# Altium schematic sheet Sheet1.SchDoc
size A4
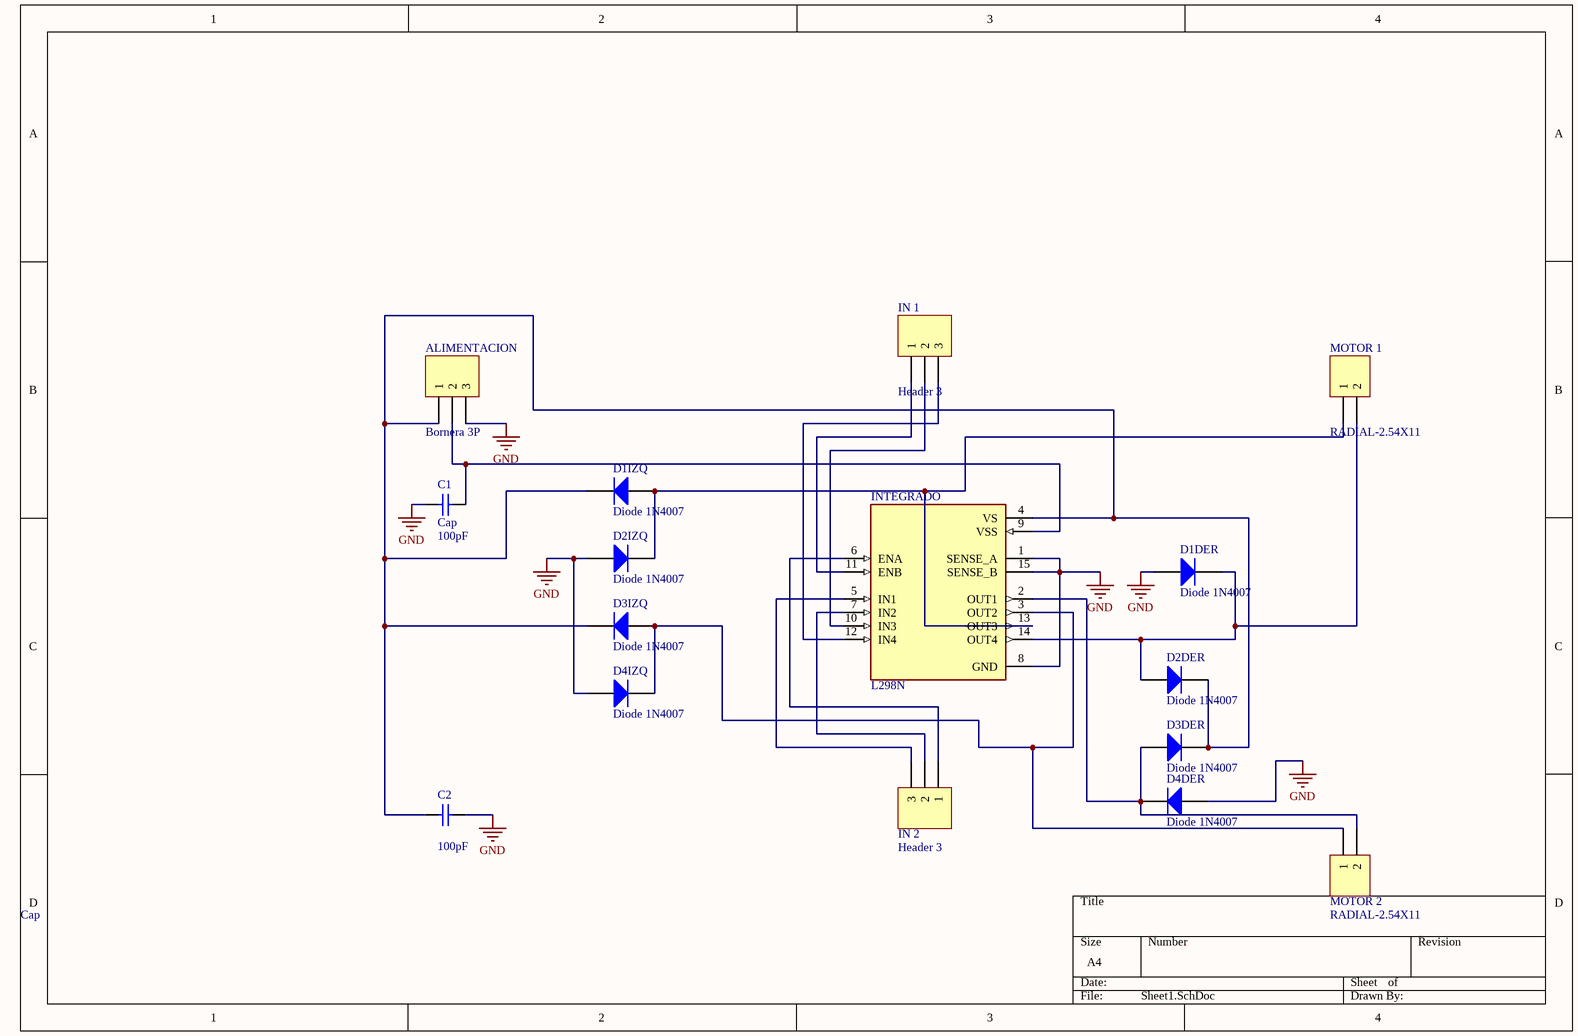
[diagram p0: Sheet1.SchDoc]

## Parts
ALIMENTACION  Bornera 3P  [Bornera 3P]
C1  Cap  value 100pF  [Capacitor]
C2  Cap  value 100pF  [Capacitor]
D1DER  Diode 1N4007  [Axial diodo]
D1IZQ  Diode 1N4007  [Axial diodo]
D2DER  Diode 1N4007  [Axial diodo]
D2IZQ  Diode 1N4007  [Axial diodo]
D3DER  Diode 1N4007  [Axial diodo]
D3IZQ  Diode 1N4007  [Axial diodo]
D4DER  Diode 1N4007  [Axial diodo]
D4IZQ  Diode 1N4007  [Axial diodo]
IN_1  Header 3  [HDR1X3]
IN_2  Header 3  [HDR1X3]
INTEGRADO  L298N  [l298n]
MOTOR_1  RADIAL-2.54X11  [Bornera 2P]
MOTOR_2  RADIAL-2.54X11  [Bornera 2P]

## Nets
GND: ALIMENTACION.3 C1.1 C2.2 D1DER.1(A) D2IZQ.1(A) D4DER.1(A) D4IZQ.1(A) INTEGRADO.1(SENSE_A) INTEGRADO.8(GND) INTEGRADO.15(SENSE_B)
NetALIMENTACION_1: ALIMENTACION.1 C2.1 D1IZQ.2(K) D2DER.2(K) D3DER.2(K) D3IZQ.2(K) INTEGRADO.4(VS)
NetALIMENTACION_2: ALIMENTACION.2 C1.2 INTEGRADO.9(VSS)
NetD1DER_2: D1DER.2(K) D2DER.1(A) INTEGRADO.14(OUT4) MOTOR_1.2
NetD1IZQ_1: D1IZQ.1(A) D2IZQ.2(K) INTEGRADO.13(OUT3) MOTOR_1.1
NetD3DER_1: D3DER.1(A) D4DER.2(K) INTEGRADO.2(OUT1) MOTOR_2.2
NetD3IZQ_1: D3IZQ.1(A) D4IZQ.2(K) INTEGRADO.3(OUT2) MOTOR_2.1
NetIN_1_1: IN_1.1 INTEGRADO.11(ENB)
NetIN_1_2: IN_1.2 INTEGRADO.10(IN3)
NetIN_1_3: IN_1.3 INTEGRADO.12(IN4)
NetIN_2_1: IN_2.1 INTEGRADO.6(ENA)
NetIN_2_2: IN_2.2 INTEGRADO.7(IN2)
NetIN_2_3: IN_2.3 INTEGRADO.5(IN1)

## Library data of the parts
C1 C2 = Cap: Capacitor; Published: 8-Jun-2000; LatestRevisionDate: 17-Jul-2002; LatestRevisionNote: Re-released for DXP Platform.; PackageReference: RAD-0.3; Publisher: Altium Limited; PackageDescription: Radial Cap, Thru-Hole; 2 Leads; 0.3 in Pin Spacing
D1DER D1IZQ D2DER D2IZQ D3DER D3IZQ D4DER D4IZQ = Diode 1N4007: 1 Amp General Purpose Rectifier; Published: 8-Jun-2000; LatestRevisionDate: 17-Jul-2002; LatestRevisionNote: Re-released for DXP Platform.; DatasheetVersion: 1998; PackageVersion: Aug-1999; PackageReference: DO-41; Publisher: Altium Limited; PackageDescription: Diode, Axial; Body 5.2 x 2.7 mm (LxDia. max), Lead Dia. 0.86 mm (max); Code_JEDEC: DO-204-AL; ComponentLink1Description: Manufacturer Link; ComponentLink1URL: http://www.fairchildsemi.com/; ComponentLink2Description: Datasheet; ComponentLink2URL: http://www.fairchildsemi.com/ds/1N%2F1N4001.pdf
IN_1 IN_2 = Header 3: Header, 3-Pin; LatestRevisionDate: 17-Jul-2002; LatestRevisionNote: Re-released for DXP Platform.; Publisher: Altium Limited
INTEGRADO = L298N: Dual Full Bridge Motor Driver 15-Pin(15+Tab) MULTIWATT V Tube; MP: L298N; Availability: Unavailable; Package: None; Value: *; Price: None
MOTOR_1 MOTOR_2 = Bornera 2P: LatestRevisionDate: 17-Jul-2002; LatestRevisionNote: Re-released for DXP Platform.; Publisher: Altium Limited
ALIMENTACION = Bornera 3P: LatestRevisionDate: 17-Jul-2002; LatestRevisionNote: Re-released for DXP Platform.; Publisher: Altium Limited